# Altium schematic sheet 02_PowerDiagram.SchDoc: Power diagram
size A4; Organization: Lime Microsystems; Address1: Surrey Tech Centre; Address2: Guildford GU2 7YG; Address3: Surrey; Address4: United Kingdom; Revision: v1.3; SheetNumber: 2; SheetTotal: 9
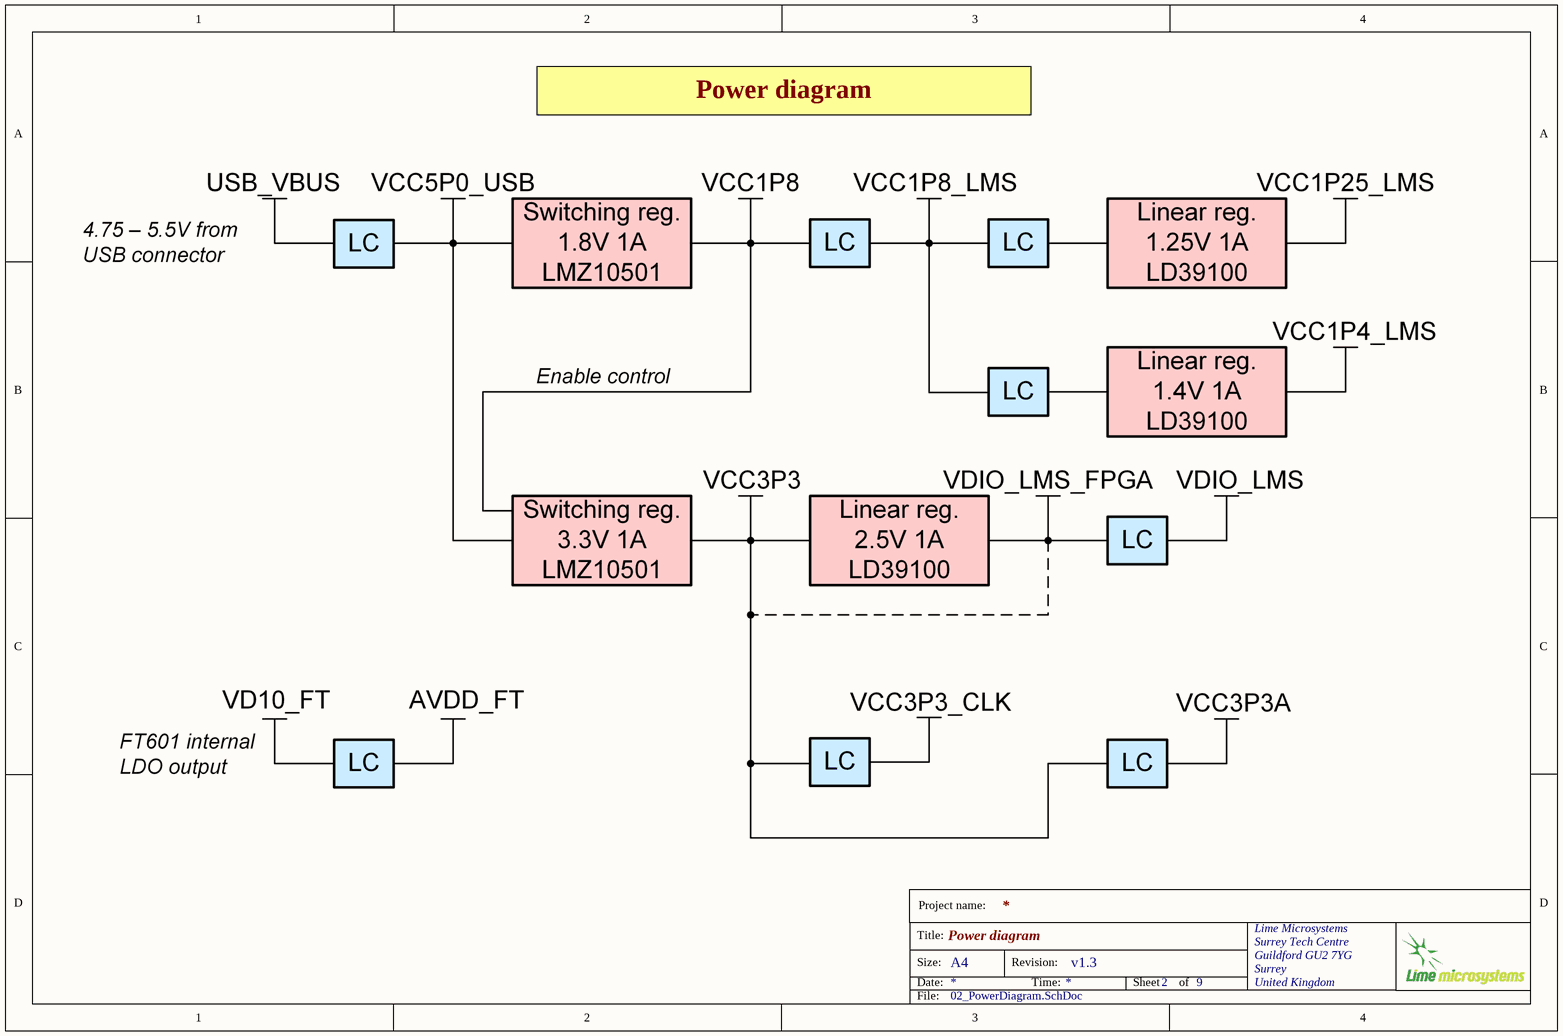
[diagram p0: 02_PowerDiagram.SchDoc]

## Notes on the sheet
- Power diagram
- Project name:
- Title:
- Size:
- Date:
- A4
- Revision:
- Time:
- Sheet
- of
- File: